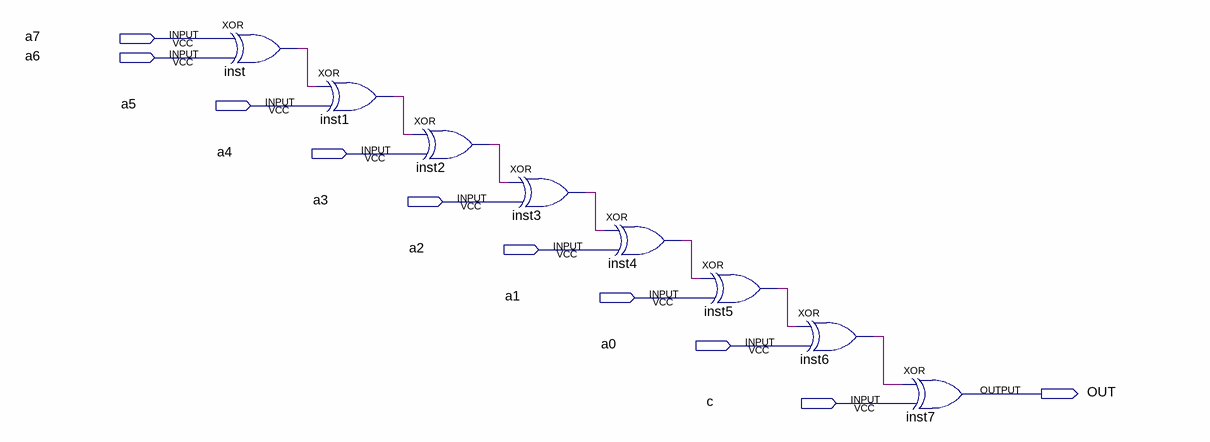
[diagram p0: schematic sheet]
// Quartus schematic XOR_9_BIT.bdf as structural Verilog: 8 symbols, 10 pins
module XOR_9_BIT (
  input  a7,
  input  a6,
  input  a5,
  input  a4,
  input  a3,
  input  a2,
  input  a1,
  input  a0,
  input  c,
  output OUT
);

  wire inst1_out, inst2_out, inst3_out, inst4_out, inst5_out, inst6_out, inst_out;

  xor inst (inst_out, a7, a6);
  xor inst1 (inst1_out, inst_out, a5);
  xor inst2 (inst2_out, inst1_out, a4);
  xor inst3 (inst3_out, inst2_out, a3);
  xor inst4 (inst4_out, inst3_out, a2);
  xor inst5 (inst5_out, inst4_out, a1);
  xor inst6 (inst6_out, inst5_out, a0);
  xor inst7 (OUT, inst6_out, c);
endmodule
